# Altium schematic sheet MCU_IO.SchDoc
size A4; Organization: Altium Limited; Address1: L3, 12a Rodborough Rd; Address2: Frenchs Forest; Address3: NSW; Address4: Australia 2086; SheetNumber: 4; SheetTotal: 5
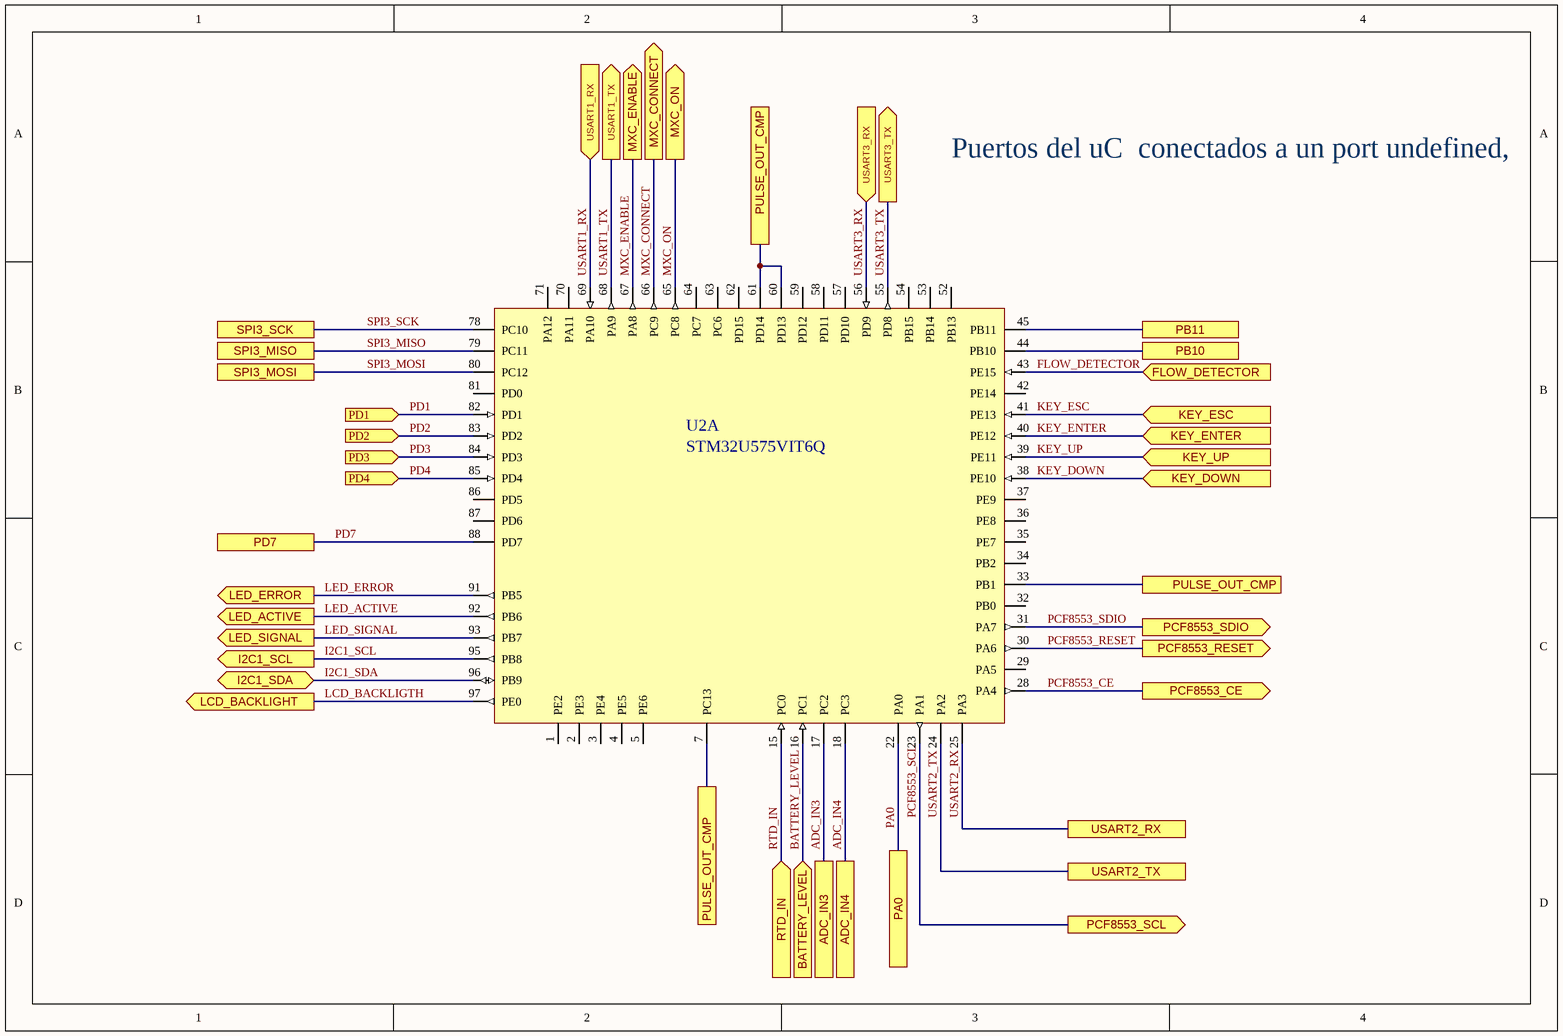
[diagram p0: MCU_IO.SchDoc]

## Parts
U2  STM32U575VIT6Q  [STM32U575VI]  (part A of 3)

## Ports
ADC_IN3, ADC_IN4, BATTERY_LEVEL (in), FLOW_DETECTOR (in), I2C1_SCL (out), I2C1_SDA (bidir), KEY_DOWN (in), KEY_ENTER (in), KEY_ESC (in), KEY_UP (in), LCD_BACKLIGHT (out), LED_ACTIVE (out), LED_ERROR (out), LED_SIGNAL (out), MXC_CONNECT (out), MXC_ENABLE (out), MXC_ON (out), PA0, PB10, PB11, PCF8553_CE (out), PCF8553_RESET (out), PCF8553_SCL (out), PCF8553_SDIO (out), PD1 (in), PD2 (in), PD3 (in), PD4 (in), PD7, PULSE_OUT_CMP, RTD_IN (in), SPI3_MISO, SPI3_MOSI, SPI3_SCK, USART1_RX (in), USART1_TX (out), USART2_RX, USART2_TX, USART3_RX (in), USART3_TX (out)

## Nets
ADC_IN3: U2.17(PC2) ; port ADC_IN3
ADC_IN4: U2.18(PC3) ; port ADC_IN4
BATTERY_LEVEL: U2.16(PC1) ; port BATTERY_LEVEL
FLOW_DETECTOR: U2.43(PE15) ; port FLOW_DETECTOR
I2C1_SCL: U2.95(PB8) ; port I2C1_SCL
I2C1_SDA: U2.96(PB9) ; port I2C1_SDA
KEY_DOWN: U2.38(PE10) ; port KEY_DOWN
KEY_ENTER: U2.40(PE12) ; port KEY_ENTER
KEY_ESC: U2.41(PE13) ; port KEY_ESC
KEY_UP: U2.39(PE11) ; port KEY_UP
LCD_BACKLIGTH: U2.97(PE0) ; port LCD_BACKLIGHT
LED_ACTIVE: U2.92(PB6) ; port LED_ACTIVE
LED_ERROR: U2.91(PB5) ; port LED_ERROR
LED_SIGNAL: U2.93(PB7) ; port LED_SIGNAL
MXC_CONNECT: U2.66(PC9) ; port MXC_CONNECT
MXC_ENABLE: U2.67(PA8) ; port MXC_ENABLE
MXC_ON: U2.65(PC8) ; port MXC_ON
PA0: U2.22(PA0) ; port PA0
PB10: U2.44(PB10) ; port PB10
PB11: U2.45(PB11) ; port PB11
PCF8553_CE: U2.28(PA4) ; port PCF8553_CE
PCF8553_RESET: U2.30(PA6) ; port PCF8553_RESET
PCF8553_SCL: U2.23(PA1) ; port PCF8553_SCL
PCF8553_SDIO: U2.31(PA7) ; port PCF8553_SDIO
PD1: U2.82(PD1) ; port PD1
PD2: U2.83(PD2) ; port PD2
PD3: U2.84(PD3) ; port PD3
PD4: U2.85(PD4) ; port PD4
PD7: U2.88(PD7) ; port PD7
PULSE_OUT_CMP: U2.7(PC13) U2.33(PB1) U2.60(PD13) U2.61(PD14) ; port PULSE_OUT_CMP
RTD_IN: U2.15(PC0) ; port RTD_IN
SPI3_MISO: U2.79(PC11) ; port SPI3_MISO
SPI3_MOSI: U2.80(PC12) ; port SPI3_MOSI
SPI3_SCK: U2.78(PC10) ; port SPI3_SCK
USART1_RX: U2.69(PA10) ; port USART1_RX
USART1_TX: U2.68(PA9) ; port USART1_TX
USART2_RX: U2.25(PA3) ; port USART2_RX
USART2_TX: U2.24(PA2) ; port USART2_TX
USART3_RX: U2.56(PD9) ; port USART3_RX
USART3_TX: U2.55(PD8) ; port USART3_TX

Not connected (* = marked no-connect by the designer): U2 1(PE2) 2(PE3) 3(PE4) 4(PE5) 5(PE6) 29(PA5) 32(PB0) 34(PB2) 35(PE7) 36(PE8) 37(PE9) 42(PE14) 52(PB13) 53(PB14) 54(PB15) 57(PD10) 58(PD11) 59(PD12) 62(PD15) 63(PC6) 64(PC7) 70(PA11) 71(PA12) 81(PD0) 86(PD5) 87(PD6)

## Notes on the sheet
- Puertos del uC  conectados a un port undefined, tienen funcion sugerida  pero no definida.
- Title:
- Size: A4
- Date:
- FMC-320U MODEL A
- Sheet:
- Time:
- Of:
- Version:
- Revision:
- Release:
- 1
- 0
- FLOWMEET SRL
- File

## Library data of the parts
U2 = STM32U575VI_1: Manufacturer: ST; Manufacturer Part Number: STM32U575VIT6Q; Category: Microcontrolador; Datasheet: https://www.st.com/resource/en/datasheet/stm32u575ag.pdf; Temperature Max: 85; Temperature Min: -40